# EasyEDA Pro project MSDRv2.eprj, board BBC_2024_REUSE
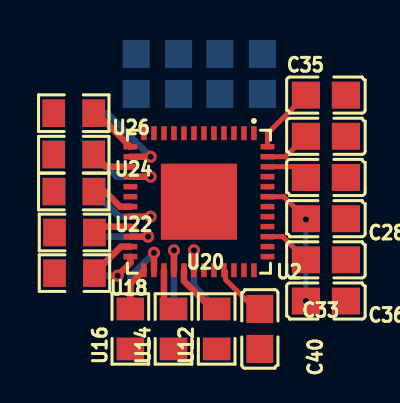
[diagram p8: board, top side]
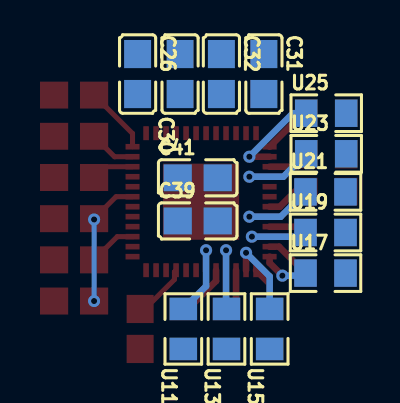
[diagram p9: board, bottom side, seen from below]

No outline. copper layers: Top Layer, Bottom Layer. Coordinates in mm from the lowest, leftmost part position.
Stack: Top Layer 0.035mm / Dielectric1 1.51mm FR4 er 4.5 / Bottom Layer 0.035mm

## Design rules (mm)
template: JLCPCB Capability(Two Layers Board)
spacing copperThickness1oz (default): track to track 0.102, other pairs 0.152 to 0.3
spacing copperThickness2oz: track to track 0.203, other pairs 0.152 to 0.3
track width copperThickness1oz (default): min 0.127, default 0.254, max 2.54
track width copperThickness2oz: min 0.203, default 0.254, max 2.54
differential pair differentialPair (default): width min 0.127, default 0.254, max 2.54; gap min 0.152, default 0.152
via viaSize (default): diameter min 0.5, default 0.61, max 10; hole min 0.3, default 0.305, max 6.3

## Placement (name value [footprint] x y rotation side)
C26  330nF  [C0805]  9.43 12.75 270 bottom
C28  100nF  [C0805]  12.61 5.52 180 top
C30  100nF  [C0805]  7.31 12.75 90 bottom
C31  100nF  [C0805]  3.12 12.75 270 bottom
C32  100nF  [C0805]  5.24 12.75 270 bottom
C33  100nF  [C0805]  12.61 3.46 0 top
C35  330nF  [C0805]  12.61 11.7 0 top
C36  100nF  [C0805]  12.61 1.4 180 top
C37  330nF  [C0805]  12.61 9.64 180 top
C38  100nF  [C0805]  12.61 7.58 180 top
C39  100nF  [C0805]  6.43 5.4 180 bottom
C40  100nF  [C0805]  9.31 0 90 top
C41  100nF  [C0805]  6.43 7.56 180 bottom
U2  MAX5864ETM+  [QFN-48_L7.0-W7.0-P0.50-BL-EP5.1]  6.26 6.37 180 top
U11  100  [R0805]  7.15 0 90 bottom
U12  100  [R0805]  7.15 0 90 top
U13  100  [R0805]  4.99 0 90 bottom
U14  100  [R0805]  4.99 0 90 top
U15  100  [R0805]  2.83 0 90 bottom
U16  100  [R0805]  2.83 0 90 top
U17  100  [R0805]  0.04 2.79 180 bottom
U18  100  [R0805]  0.04 2.79 180 top
U19  100  [R0805]  0.04 4.83 180 bottom
U20  100  [R0805]  0.04 4.83 180 top
U21  100  [R0805]  0.04 6.86 180 bottom
U22  100  [R0805]  0 6.88 180 top
U23  100  [R0805]  0 8.76 180 bottom
U24  100  [R0805]  0 8.72 180 top
U25  100  [R0805]  0 10.8 180 bottom
U26  100  [R0805]  0 10.8 180 top

## Footprints (pads in the part's own frame, mm; a bottom-side part is the same pattern mirrored in y, then rotated)
C0805
  rect 1.41x1.35 smd: 1(-1,0) 2(1,0)
QFN-48_L7.0-W7.0-P0.50-BL-EP5.1
  rect 0.28x0.7 smd: 1(-2.75,-3.428) 2(-2.25,-3.428) 3(-1.75,-3.428) 4(-1.25,-3.428) 5(-0.75,-3.428) 6(-0.25,-3.428) 7(0.25,-3.428) 8(0.75,-3.428) 9(1.25,-3.428) 10(1.75,-3.428) 11(2.25,-3.428) 12(2.75,-3.428) 25(2.75,3.428) 26(2.25,3.428) 27(1.75,3.428) 28(1.25,3.428) 29(0.75,3.428) 30(0.25,3.428) 31(-0.25,3.428) 32(-0.75,3.428) 33(-1.25,3.428) 34(-1.75,3.428) 35(-2.25,3.428) 36(-2.75,3.428)
  rect 0.7x0.28 smd: 13(3.428,-2.75) 14(3.428,-2.25) 15(3.428,-1.75) 16(3.428,-1.25) 17(3.428,-0.75) 18(3.428,-0.25) 19(3.428,0.25) 20(3.428,0.75) 21(3.428,1.25) 22(3.428,1.75) 23(3.428,2.25) 24(3.428,2.75) 37(-3.428,2.75) 38(-3.428,2.25) 39(-3.428,1.75) 40(-3.428,1.25) 41(-3.428,0.75) 42(-3.428,0.25) 43(-3.428,-0.25) 44(-3.428,-0.75) 45(-3.428,-1.25) 46(-3.428,-1.75) 47(-3.428,-2.25) 48(-3.428,-2.75)
  rect 3.81x3.81 smd: 49(0,0)
R0805
  rect 1.133x1.377 smd: 1(-1,0) 2(1,0)

## Nets
As in the schematic.

Pads without a net: U2 17 38 49

## Via types
v1: diameter 0.61, hole 0.305, Top Layer to Bottom Layer, 10 vias

## Routing (per net, layer and track width the routed paths; a pad name or vN(x,y) marks a point on that pad's centre or on a via; arc(x,y) is an arc through that point)
VCC: length 13.9
  Top Layer w0.254: U2.43 10.51,6.62 C28.2 v1(11.61,5.48) ; C38.2 11.07,8.12 U2.46 ; U2.33 7.59,2.86 7.59,2.47 9.07,1 C40.2 ; C33.1 10.45,4.62 U2.39
  Bottom Layer w0.254: v1(11.61,1.4) v1(11.61,5.48)
$1N1602: length 2.3
  Top Layer w0.254: U2.47 10.59,8.62 C37.2
$1N1605: length 4.4
  Top Layer w0.33: U2.30 v1(6.01,3.94)
  Bottom Layer w0.33: U11.2 6.01,2.14 v1(6.01,3.94)
$1N1608: length 2.8
  Top Layer w0.33: U2.29 5.51,2.4 6.91,1 U12.2
$1N1611: length 3.9
  Top Layer w0.33: U2.28 v1(5.01,3.94)
  Bottom Layer w0.33: U13.2 5.01,1.02 v1(5.01,3.94)
$1N1614: length 2.1
  Top Layer w0.33: U2.27 4.51,1.48 U14.2
$1N1617: length 4.2
  Top Layer w0.33: U2.26 v1(4.01,3.81)
  Bottom Layer w0.33: v1(4.01,3.81) 2.83,2.63 U15.2
$1N1620: length 2.2
  Top Layer w0.33: U2.25 2.83,2.26 U16.2
$1N1625: length 2.4
  Top Layer w0.33: v1(2.19,2.67) 2.83,3.31 U2.24
  Bottom Layer w0.33: v1(2.19,2.67) 1.16,2.67 U17.1
$1N1628: length 2.3
  Top Layer w0.33: U18.1 2.36,4.12 U2.23
$1N1633: length 1.9
  Top Layer w0.33: U2.21 1.33,5.12 U20.1
$1N1636: length 4.3
  Top Layer w0.33: U2.20 v1(3.85,5.62)
  Bottom Layer w0.33: v1(3.85,5.62) 2.28,5.62 U21.1
$1N1639: length 2.1
  Top Layer w0.33: U2.19 2.32,6.12 1.56,6.88 U22.1
$1N1642: length 4.3
  Top Layer w0.33: U2.16 v1(3.85,7.62)
  Bottom Layer w0.33: v1(3.85,7.62) 2.15,7.62 U23.1
$1N1645: length 2.1
  Top Layer w0.33: U2.15 1.6,8.12 U24.1
$1N1648: length 4.8
  Top Layer w0.33: U2.14 v1(3.85,8.62)
  Bottom Layer w0.33: v1(3.85,8.62) 1.67,10.8 U25.1
$1N1651: length 2.5
  Top Layer w0.33: U2.13 1.16,10.8 U26.1
$1N1653: length 3.4
  Top Layer w0.254: C35.1 9.69,9.78 U2.48
$1N1662: length 3.7
  Top Layer w0.33: U2.22 v1(3.72,4.62)
  Bottom Layer w0.33: U19.1 1.25,4.62 v1(3.72,4.62)
